# EAGLE schematic Lamp Logic Board_22 Power 2 (EAGLE 9.5.1)
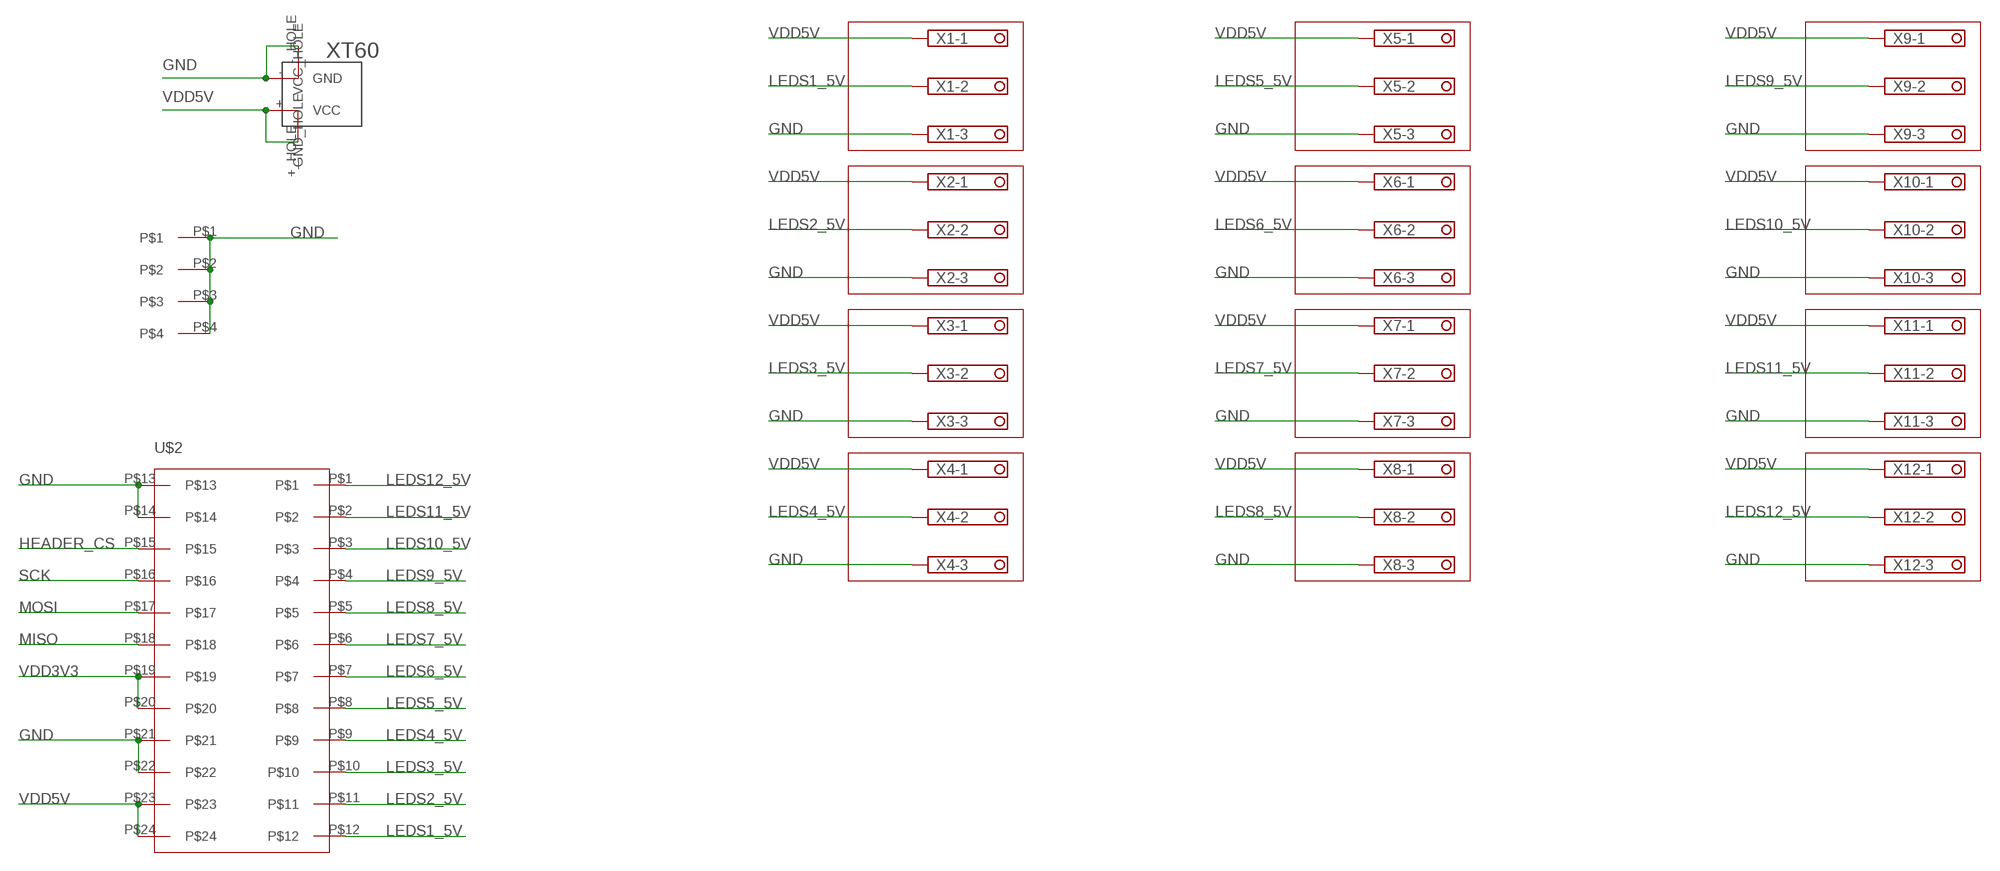
[diagram p0: schematic, sheet 1]

## Parts
U$1  POWERBOARD_TEMPLATEPOWERBOARD_TEMPLATE  [4,PIECE]
U$2  MY_HEADER  [MY_HEADER]
U$3  XT60  [XT60]
X1  TERMINAL-BLOCK-3.5MM-3-PIN-LONG-PAD  [TERMINAL-BLOCK-3-PIN-3.5MM-LONG-PAD]
X2  TERMINAL-BLOCK-3.5MM-3-PIN-LONG-PAD  [TERMINAL-BLOCK-3-PIN-3.5MM-LONG-PAD]
X3  TERMINAL-BLOCK-3.5MM-3-PIN-LONG-PAD  [TERMINAL-BLOCK-3-PIN-3.5MM-LONG-PAD]
X4  TERMINAL-BLOCK-3.5MM-3-PIN-LONG-PAD  [TERMINAL-BLOCK-3-PIN-3.5MM-LONG-PAD]
X5  TERMINAL-BLOCK-3.5MM-3-PIN-LONG-PAD  [TERMINAL-BLOCK-3-PIN-3.5MM-LONG-PAD]
X6  TERMINAL-BLOCK-3.5MM-3-PIN-LONG-PAD  [TERMINAL-BLOCK-3-PIN-3.5MM-LONG-PAD]
X7  TERMINAL-BLOCK-3.5MM-3-PIN-LONG-PAD  [TERMINAL-BLOCK-3-PIN-3.5MM-LONG-PAD]
X8  TERMINAL-BLOCK-3.5MM-3-PIN-LONG-PAD  [TERMINAL-BLOCK-3-PIN-3.5MM-LONG-PAD]
X9  TERMINAL-BLOCK-3.5MM-3-PIN-LONG-PAD  [TERMINAL-BLOCK-3-PIN-3.5MM-LONG-PAD]
X10  TERMINAL-BLOCK-3.5MM-3-PIN-LONG-PAD  [TERMINAL-BLOCK-3-PIN-3.5MM-LONG-PAD]
X11  TERMINAL-BLOCK-3.5MM-3-PIN-LONG-PAD  [TERMINAL-BLOCK-3-PIN-3.5MM-LONG-PAD]
X12  TERMINAL-BLOCK-3.5MM-3-PIN-LONG-PAD  [TERMINAL-BLOCK-3-PIN-3.5MM-LONG-PAD]

## Nets
GND: U$1.P$1 U$1.P$2 U$1.P$3 U$1.P$4 U$2.P$13 U$2.P$14 U$2.P$21 U$2.P$22 U$3.-(GND) U$3.-_HOLE(GND_HOLE) X1.3 X2.3 X3.3 X4.3 X5.3 X6.3 X7.3 X8.3 X9.3 X10.3 X11.3 X12.3
HEADER_CS: U$2.P$15
LEDS1_5V: U$2.P$12 X1.2
LEDS2_5V: U$2.P$11 X2.2
LEDS3_5V: U$2.P$10 X3.2
LEDS4_5V: U$2.P$9 X4.2
LEDS5_5V: U$2.P$8 X5.2
LEDS6_5V: U$2.P$7 X6.2
LEDS7_5V: U$2.P$6 X7.2
LEDS8_5V: U$2.P$5 X8.2
LEDS9_5V: U$2.P$4 X9.2
LEDS10_5V: U$2.P$3 X10.2
LEDS11_5V: U$2.P$2 X11.2
LEDS12_5V: U$2.P$1 X12.2
MISO: U$2.P$18
MOSI: U$2.P$17
SCK: U$2.P$16
VDD3V3: U$2.P$19 U$2.P$20
VDD5V: U$2.P$23 U$2.P$24 U$3.+(VCC) U$3.+_HOLE(VCC_HOLE) X1.1 X2.1 X3.1 X4.1 X5.1 X6.1 X7.1 X8.1 X9.1 X10.1 X11.1 X12.1

## Library data of the parts
U$1 = QUICKFIT_RISER_THING:POWERBOARD_TEMPLATE
U$2 = MY_HEADER:MY_HEADER
U$3 = XT60:XT60: XT60
X1-X12 = Rembrandt Electronics - Terminal Block 3-5mm v1-0:TERMINAL-BLOCK-3.5MM-3-PIN: Terminal Block 3.5mm Pitch: 3,5 mm Number of pins: 3 Created by Rembrandt Electronics www.rembrandtelectronics.com